# Altium schematic sheet Sheet1.SchDoc
size A4
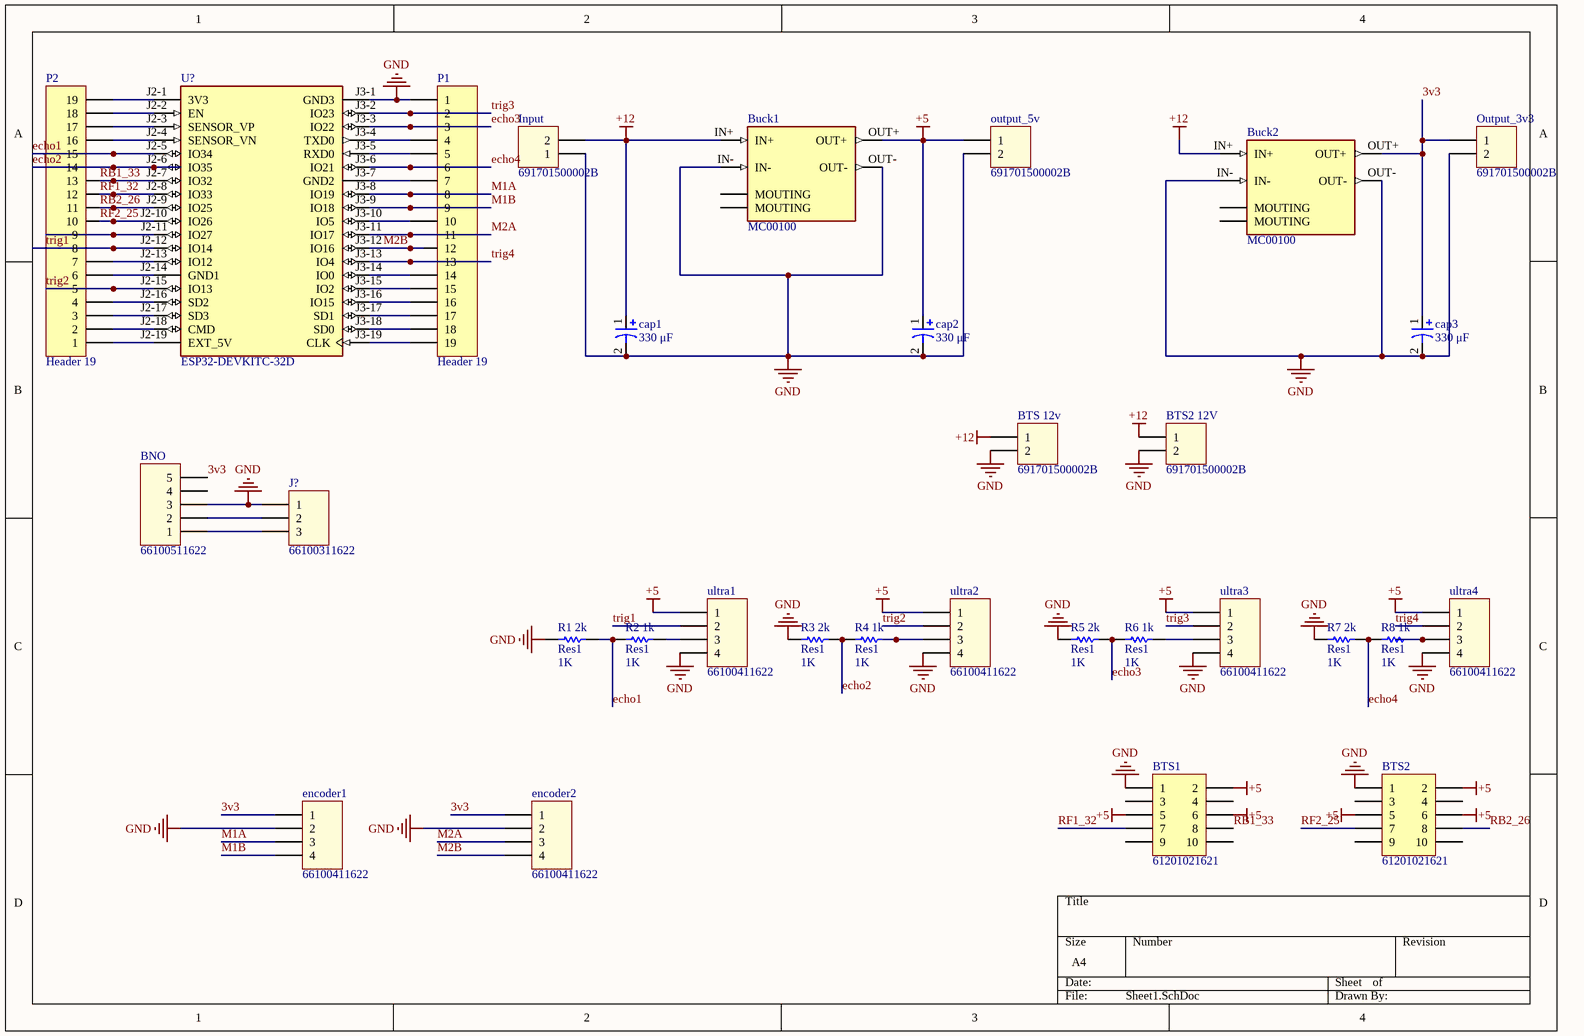
[diagram p0: Sheet1.SchDoc]

## Parts
BNO  66100511622  [66100511622]
BTS1  61201021621  [61201021621]
BTS2  61201021621  [61201021621]
BTS2_12V  691701500002B  [691701500002B]
BTS_12v  691701500002B  [691701500002B]
Buck1  MC00100  [LM2596_Voltmeter_Module]
Buck2  MC00100  [LM2596_Voltmeter_Module]
cap1  330 μF  [WCAP-AT1H 8x11.5x3.5x0.5]
cap2  330 μF  [WCAP-AT1H 8x11.5x3.5x0.5]
cap3  330 μF  [WCAP-AT1H 8x11.5x3.5x0.5]
encoder1  66100411622  [66100411622]
encoder2  66100411622  [66100411622]
Input  691701500002B  [691701500002B]
J?  66100311622  [66100311622]
Output_3v3  691701500002B  [691701500002B]
output_5v  691701500002B  [691701500002B]
P1  Header 19  [HDR1X19]
P2  Header 19  [HDR1X19]
R1_2k  Res1  value 1K  [AXIAL-0.3]
R2_1k  Res1  value 1K  [AXIAL-0.3]
R3_2k  Res1  value 1K  [AXIAL-0.3]
R4_1k  Res1  value 1K  [AXIAL-0.3]
R5_2k  Res1  value 1K  [AXIAL-0.3]
R6_1k  Res1  value 1K  [AXIAL-0.3]
R7_2k  Res1  value 1K  [AXIAL-0.3]
R8_1k  Res1  value 1K  [AXIAL-0.3]
U?  ESP32-DEVKITC-32D  [MODULE_ESP32-DEVKITC-32D]
ultra1  66100411622  [66100411622]
ultra2  66100411622  [66100411622]
ultra3  66100411622  [66100411622]
ultra4  66100411622  [66100411622]

## Nets
+5: BTS1.2 BTS1.5 BTS1.6 BTS2.2 BTS2.5 BTS2.6 Buck1.OUT+ cap2.1 output_5v.1 ultra1.1 ultra2.1 ultra3.1 ultra4.1
+12: BTS2_12V.1 BTS_12v.1 Buck1.IN+ Buck2.IN+ cap1.1 Input.2
GND: BNO.3 BTS1.1 BTS2.1 BTS2_12V.2 BTS_12v.2 Buck1.IN- Buck1.OUT- Buck2.IN- Buck2.OUT- cap1.2 cap2.2 cap3.2 encoder1.2 encoder2.2 Input.1 J?.1 Output_3v3.2 output_5v.2 P1.1 R1_2k.1 R3_2k.1 R5_2k.1 R7_2k.1 U?.J3-1(GND3) ultra1.4 ultra2.4 ultra3.4 ultra4.4
3v3: BNO.5 Buck2.OUT+ cap3.1 encoder1.1 encoder2.1 Output_3v3.1
\: P2.15 R1_2k.2 R2_1k.1 U?.J2-5(IO34)  [also labelled echo1]
echo2: P2.14 R3_2k.2 R4_1k.1 U?.J2-6(IO35)
echo3: P1.3 R5_2k.2 R6_1k.1 U?.J3-3(IO22)
echo4: P1.6 R7_2k.2 R8_1k.1 U?.J3-6(IO21)
M1A: encoder1.3 P1.8 U?.J3-8(IO19)
M1B: encoder1.4 P1.9 U?.J3-9(IO18)
M2A: encoder2.3 P1.11 U?.J3-11(IO17)
M2B: encoder2.4 P1.12 U?.J3-12(IO16)
RB1_33: BTS1.8 P2.13 U?.J2-7(IO32)
RB2_26: BTS2.8 P2.11 U?.J2-9(IO25)
RF1_32: BTS1.7 P2.12 U?.J2-8(IO33)
RF2_25: BTS2.7 P2.10 U?.J2-10(IO26)
trig1: P2.8 U?.J2-12(IO14) ultra1.2
trig2: P2.5 U?.J2-15(IO13) ultra2.2
trig3: P1.2 U?.J3-2(IO23) ultra3.2
trig4: P1.13 U?.J3-13(IO4) ultra4.2
NetBNO_1: BNO.1 J?.3
NetBNO_2: BNO.2 J?.2
NetP1_4: P1.4 U?.J3-4(TXD0)
NetP1_5: P1.5 U?.J3-5(RXD0)
NetP1_7: P1.7 U?.J3-7(GND2)
NetP1_10: P1.10 U?.J3-10(IO5)
NetP1_14: P1.14 U?.J3-14(IO0)
NetP1_15: P1.15 U?.J3-15(IO2)
NetP1_16: P1.16 U?.J3-16(IO15)
NetP1_17: P1.17 U?.J3-17(SD1)
NetP1_18: P1.18 U?.J3-18(SD0)
NetP1_19: P1.19 U?.J3-19(CLK)
NetP2_1: P2.1 U?.J2-19(EXT_5V)
NetP2_2: P2.2 U?.J2-18(CMD)
NetP2_3: P2.3 U?.J2-17(SD3)
NetP2_4: P2.4 U?.J2-16(SD2)
NetP2_6: P2.6 U?.J2-14(GND1)
NetP2_7: P2.7 U?.J2-13(IO12)
NetP2_9: P2.9 U?.J2-11(IO27)
NetP2_16: P2.16 U?.J2-4(SENSOR_VN)
NetP2_17: P2.17 U?.J2-3(SENSOR_VP)
NetP2_18: P2.18 U?.J2-2(EN)
NetP2_19: P2.19 U?.J2-1(3V3)
NetR2_1k_2: R2_1k.2 ultra1.3
NetR4_1k_2: R4_1k.2 ultra2.3
NetR6_1k_2: R6_1k.2 ultra3.3
NetR8_1k_2: R8_1k.2 ultra4.3

Not connected (* = marked no-connect by the designer): BNO 4; BTS1 3 4 9 10; BTS2 3 4 9 10; Buck1 MH1(MOUTING) MH2(MOUTING); Buck2 MH1(MOUTING) MH2(MOUTING)

## Library data of the parts
BNO = 66100511622: WR-WTB 2.54 mm Intercom Male Horizontal Shrouded Header, 5p; Pitch: 2.54 mm; Pin Number: 5; ComponentLink1Description: Manufacturer; ComponentLink1URL: http://www.we-online.de; ComponentLink2Description: Datasheet; ComponentLink2URL: http://katalog.we-online.de/em/datasheet/6610XX11622.pdf; Part Number: 66100511622; Published Date: June 2017; Publisher: Wurth Elektronik
BTS1 BTS2 = 61201021621: WR-BHD 2.54mm Male Box Header; Manufacturer: Wurth Elektronik; ComponentLink1 Description: Manufacturer; ComponentLink2 Description: Datasheet; NoPins: 10; Created Date: March 2016; partNo: 61201021621; ComponentLink1URL: http://www.we-online.com; ComponentLink2URL: http://katalog.we-online.de/em/datasheet/6120xx21621.pdf; Created by: Baojun Chen
BTS2_12V BTS_12v Input Output_3v3 output_5v = 691701500002B: WR-TBL Serie 7015 B - 5.08 mm Open Vertical PCB Header THR Type, 02p; Pitch: 5.08 mm; ComponentLink1Description: Manufacturer; ComponentLink1URL: http://www.we-online.de; ComponentLink2Description: Datasheet; ComponentLink2URL: http://katalog.we-online.de/em/datasheet/6917015000xxB.pdf; Part Number: 691701500002B; Published Date: Feb. 2017; Publisher: Wurth Elektronik; Pin Number: 02p
Buck1 Buck2 = MC00100: DC-DC LM2596 Step Down Adjustable Converter Power Supply Module 1.3V-35V; MF: YKS; SnapEDA_Link: https://www.snapeda.com/parts/MC00100/YKS/view-part/?ref=snap; Package: None; Value: *; MP: MC00100; Check_prices: https://www.snapeda.com/parts/MC00100/YKS/view-part/?ref=eda
cap1-cap3 = WCAP-AT1H 8x11.5x3.5x0.5 860240274006: WCAP-AT1H Aluminum Electrolytic Capacitors , 330 μF; + / - 20%; 10 V , 8 x 11,5; Manufacturer: Wurth Elektronik; E-mail: libraries@we-online.com; Characteristics: Aluminum Electrolytic Capacitor; Recommended soldering: Wave; Operating temperature:–40 °C to +105 °C for UR < 400 V; –25 °C to +105 °C for UR ≥ 400 V; Long life product series; Higher permissible ripple current; Load life: 5000–10000 h @ +105 °C; ComponentLink1Description: Manufacturer; ComponentLink1URL: http://www.we-online.com; ComponentLink2Description: Datasheet; ComponentLink2URL: http://katalog.we-online.de/pbs/datasheet/860240274006.pdf; Created by: Karrer Zheng; Created Date: 6/8/2015; Capacitance: 330 μF; Application: Medium and high voltage type range from 160V-450V used as primary side input filter in power supply; Low voltage type used as energy storage or low frequency filtering in circuit, applied to general switching power supply, AC-DC converter, adapter, charger, TV, VCR, DC motor circuit filter, digital audio, digital cameras, digital video cameras, satellite receiver etc.; partNo: 860240274006
encoder1 encoder2 ultra1-ultra4 = 66100411622: WR-WTB 2.54 mm Intercom Male Horizontal Shrouded Header, 4p; Pitch: 2.54 mm; Pin Number: 4; ComponentLink1Description: Manufacturer; ComponentLink1URL: http://www.we-online.de; ComponentLink2Description: Datasheet; ComponentLink2URL: http://katalog.we-online.de/em/datasheet/6610XX11622.pdf; Part Number: 66100411622; Published Date: June 2017; Publisher: Wurth Elektronik
J? = 66100311622: WR-WTB 2.54 mm Intercom Male Horizontal Shrouded Header, 3p; Pitch: 2.54 mm; Pin Number: 3; ComponentLink1Description: Manufacturer; ComponentLink1URL: http://www.we-online.de; ComponentLink2Description: Datasheet; ComponentLink2URL: http://katalog.we-online.de/em/datasheet/6610XX11622.pdf; Part Number: 66100311622; Published Date: June 2017; Publisher: Wurth Elektronik
P1 P2 = Header 19: Header, 19-Pin; LatestRevisionDate: 17-Jul-2002; LatestRevisionNote: Re-released for DXP Platform.; Publisher: Altium Limited
R1_2k R2_1k R3_2k R4_1k R5_2k R6_1k R7_2k R8_1k = Res1: Resistor; Published: 8-Jun-2000; LatestRevisionDate: 17-Jul-2002; LatestRevisionNote: Re-released for DXP Platform.; PackageReference: AXIAL-0.3; Publisher: Altium Limited; PackageDescription: Axial Device, Thru-Hole; 2 Leads; 0.3 in Pin Spacing
U? = ESP32-DEVKITC-32D: WiFi Development Tools (802.11) ESP32 General Development Kit, ESP32-WROOM-32D on the board; MF: Espressif Systems; SnapEDA_Link: https://www.snapeda.com/parts/ESP32-DEVKITC-32D/Espressif+Systems/view-part/?ref=snap; Package: None; Value: *; MP: ESP32-DEVKITC-32D; Check_prices: https://www.snapeda.com/parts/ESP32-DEVKITC-32D/Espressif+Systems/view-part/?ref=eda